# EAGLE design gsm (EAGLE 6.3)
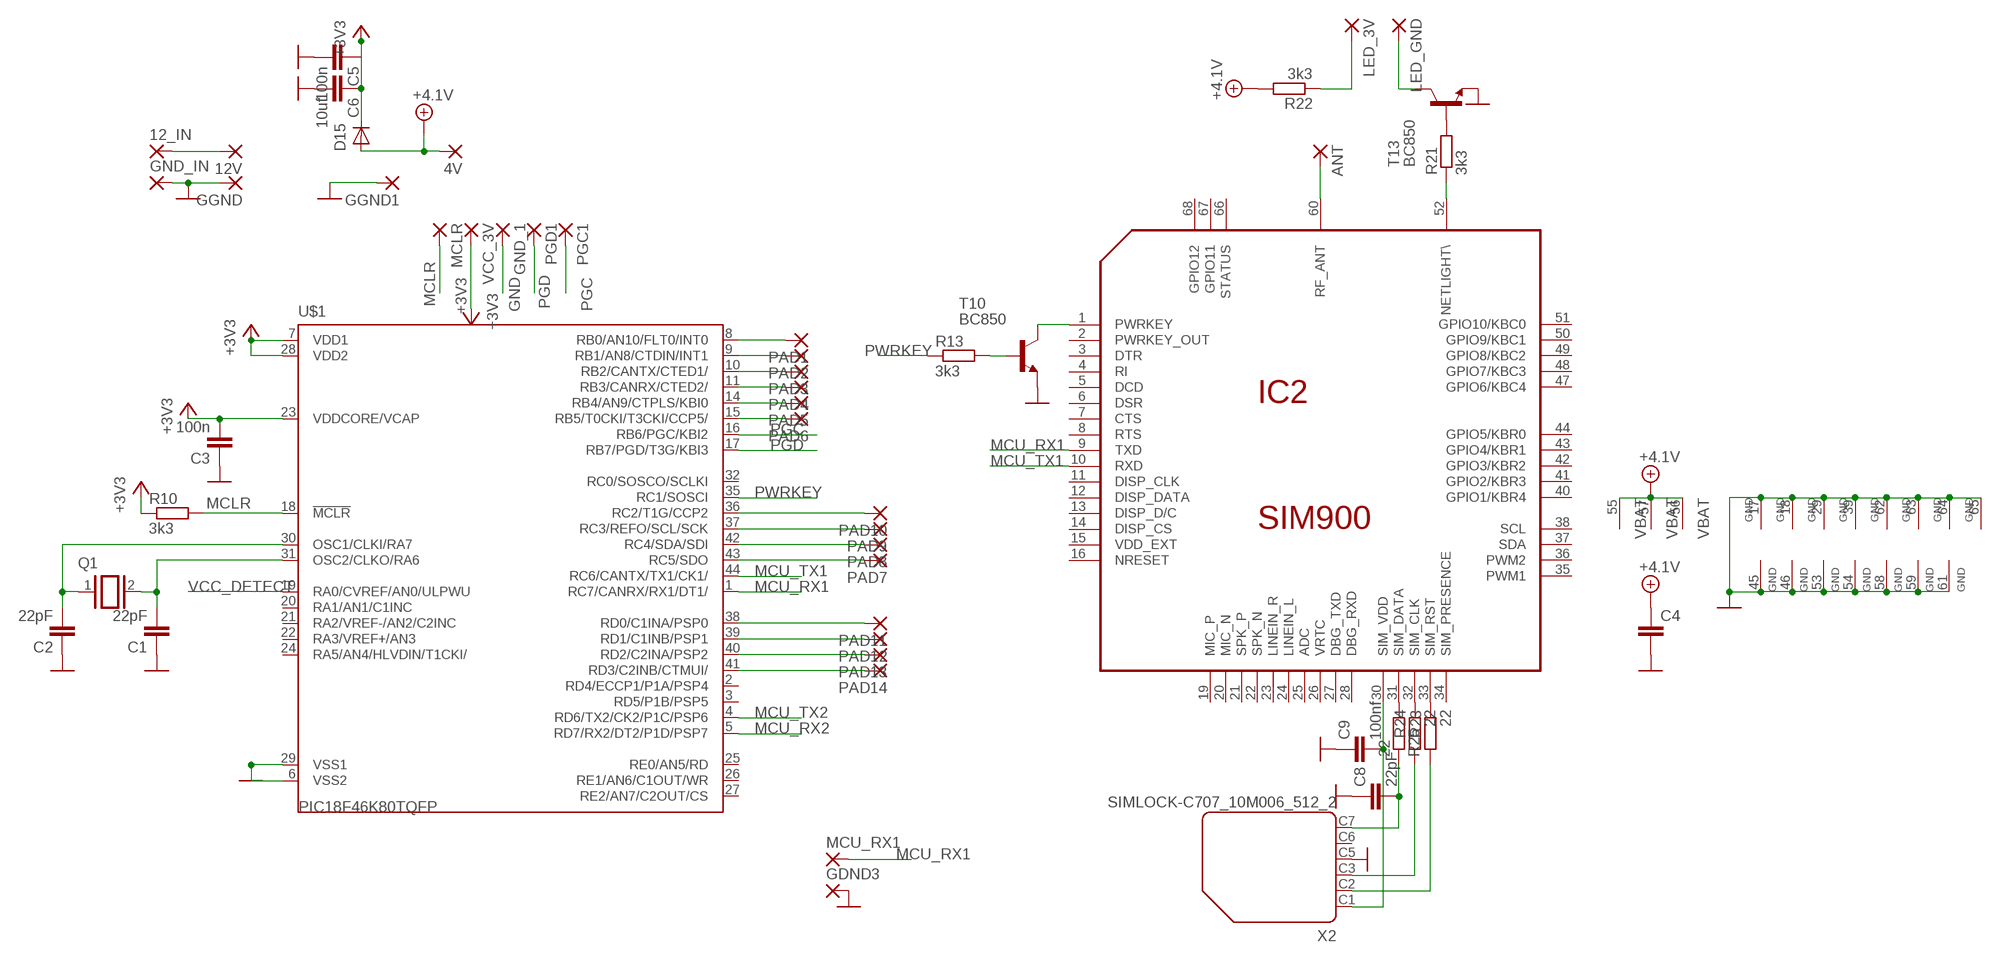
[diagram p0: schematic, sheet 1]

## Parts
4V  SMD2  [SMD1,27-2,54]
12_IN  2,15/1,0  [2,15/1,0]
12V  SMD2  [SMD1,27-2,54]
ANT  2,54/0,8  [2,54/0,8]
C1  22pF  C-EUC1206  [C1206]
C2  22pF  C-EUC1206  [C1206]
C3  100n  C-EUC1206  [C1206]
C4  C-EU025-050X050  [C025-050X050]
C5  100n  C-EUC1206  [C1206]
C6  10uf  C-EUC1206  [C1206]
C8  22pF  C-EUC1206K  [C1206K]
C9  100nf  C-EUC1206K  [C1206K]
D15  GF1  [SMA-DO214AC]
GDND3  2,15/1,0  [2,15/1,0]
GGND  SMD2  [SMD1,27-2,54]
GGND1  SMD2  [SMD1,27-2,54]
GND_1  2,15/1,0  [2,15/1,0]
GND_IN  2,15/1,0  [2,15/1,0]
IC2  SIM900  [SIM900]
LED_3V  WIREPAD2,15/1,0  [2,15/1,0]
LED_GND  WIREPAD2,15/1,0  [2,15/1,0]
MCLR  2,15/1,0  [2,15/1,0]
MCU_RX1  2,15/1,0  [2,15/1,0]
PAD1  SMD2  [SMD1,27-2,54]
PAD2  SMD2  [SMD1,27-2,54]
PAD3  SMD2  [SMD1,27-2,54]
PAD4  SMD2  [SMD1,27-2,54]
PAD5  SMD2  [SMD1,27-2,54]
PAD6  SMD2  [SMD1,27-2,54]
PAD7  SMD2  [SMD1,27-2,54]
PAD8  SMD2  [SMD1,27-2,54]
PAD9  SMD2  [SMD1,27-2,54]
PAD10  SMD2  [SMD1,27-2,54]
PAD11  SMD2  [SMD1,27-2,54]
PAD12  SMD2  [SMD1,27-2,54]
PAD13  SMD2  [SMD1,27-2,54]
PAD14  SMD2  [SMD1,27-2,54]
PGC1  2,15/1,0  [2,15/1,0]
PGD1  2,15/1,0  [2,15/1,0]
Q1  XTAL/S  [QS]
R10  3k3  R-EU_M3216  [M3216]
R13  3k3  R-EU_M3216  [M3216]
R21  3k3  R-EU_M3216  [M3216]
R22  3k3  R-EU_M3216  [M3216]
R23  22  R-EU_M1206  [M1206]
R24  22  R-EU_M1206  [M1206]
R25  22  R-EU_M1206  [M1206]
T10  BC850  [SOT23]
T13  BC850  [SOT23]
U$1  PIC18F46K80TQFP  [TQFP44]
VCC_3V  2,15/1,0  [2,15/1,0]
X2  SIMLOCK-C707_10M006_512_2  [C707_10M006_512_2]

## Nets
+3V3: C3.2 C5.1 C6.1 D15.K(C) R10.1 U$1.7(VDD1) U$1.23(VDDCORE/VCAP) U$1.28(VDD2) VCC_3V.1(P)
+4.1V: 4V.1(P) C4.1 D15.A IC2.55(VBAT) IC2.56(VBAT) IC2.57(VBAT) R22.2
GND: C1.1 C2.1 C3.1 C4.2 C5.2 C6.2 C8.1 C9.1 GDND3.1(P) GGND1.1(P) GGND.1(P) GND_1.1(P) GND_IN.1(P) IC2.17(GND) IC2.18(GND) IC2.29(GND) IC2.39(GND) IC2.45(GND) IC2.46(GND) IC2.53(GND) IC2.54(GND) IC2.58(GND) IC2.59(GND) IC2.61(GND) IC2.62(GND) IC2.63(GND) IC2.64(GND) IC2.65(GND) T10.2(E) T13.2(E) U$1.6(VSS2) U$1.29(VSS1) X2.C5
MCLR: MCLR.1(P) R10.2 U$1.18(!MCLR)
MCU_RX1: IC2.9(TXD) MCU_RX1.1(P) U$1.1(RC7/CANRX/RX1/DT1/)
MCU_RX2: U$1.5(RD7/RX2/DT2/P1D/PSP7)
MCU_TX1: IC2.10(RXD) U$1.44(RC6/CANTX/TX1/CK1/)
MCU_TX2: U$1.4(RD6/TX2/CK2/P1C/PSP6)
N$1: 12_IN.1(P) 12V.1(P)
N$6: PAD1.1(P) U$1.8(RB0/AN10/FLT0/INT0)
N$7: PAD2.1(P) U$1.9(RB1/AN8/CTDIN/INT1)
N$8: PAD3.1(P) U$1.10(RB2/CANTX/CTED1/)
N$9: PAD4.1(P) U$1.11(RB3/CANRX/CTED2/)
N$10: PAD5.1(P) U$1.14(RB4/AN9/CTPLS/KBI0)
N$11: PAD6.1(P) U$1.15(RB5/T0CKI/T3CKI/CCP5/)
N$13: PAD7.1(P) U$1.43(RC5/SDO)
N$14: PAD8.1(P) U$1.42(RC4/SDA/SDI)
N$15: PAD9.1(P) U$1.37(RC3/REFO/SCL/SCK)
N$16: PAD10.1(P) U$1.36(RC2/T1G/CCP2)
N$17: PAD11.1(P) U$1.38(RD0/C1INA/PSP0)
N$18: PAD12.1(P) U$1.39(RD1/C1INB/PSP1)
N$19: PAD13.1(P) U$1.40(RD2/C2INA/PSP2)
N$20: PAD14.1(P) U$1.41(RD3/C2INB/CTMUI/)
N$48: C2.2 Q1.1 U$1.30(OSC1/CLKI/RA7)
N$49: C1.2 Q1.2 U$1.31(OSC2/CLKO/RA6)
N$51: R13.2 T10.1(B)
N$52: IC2.1(PWRKEY) T10.3(C)
N$64: ANT.1(P) IC2.60(RF_ANT)
N$65: IC2.52(NETLIGHT\) R21.1
N$66: R21.2 T13.1(B)
N$67: LED_GND.1(P) T13.3(C)
N$68: LED_3V.1(P) R22.1
N$69: C9.2 IC2.30(SIM_VDD) X2.C1
N$70: R23.2 X2.C2
N$71: R24.2 X2.C3
N$72: C8.2 R25.1 X2.C7
N$73: IC2.33(SIM_RST) R23.1
N$74: IC2.32(SIM_CLK) R24.1
N$75: IC2.31(SIM_DATA) R25.2
PGC: PGC1.1(P) U$1.16(RB6/PGC/KBI2)
PGD: PGD1.1(P) U$1.17(RB7/PGD/T3G/KBI3)
PWRKEY: R13.1 U$1.35(RC1/SOSCI)
VCC_DETECT: U$1.19(RA0/CVREF/AN0/ULPWU)
Unconnected: IC2.2(PWRKEY_OUT) IC2.3(DTR) IC2.4(RI) IC2.5(DCD) IC2.6(DSR) IC2.7(CTS) IC2.8(RTS) IC2.11(DISP_CLK) IC2.12(DISP_DATA) IC2.13(DISP_D/C) IC2.14(DISP_CS) IC2.15(VDD_EXT) IC2.16(NRESET) IC2.19(MIC_P) IC2.20(MIC_N) IC2.21(SPK_P) IC2.22(SPK_N) IC2.23(LINEIN_R) IC2.24(LINEIN_L) IC2.25(ADC) IC2.26(VRTC) IC2.27(DBG_TXD) IC2.28(DBG_RXD) IC2.34(SIM_PRESENCE) IC2.35(PWM1) IC2.36(PWM2) IC2.37(SDA) IC2.38(SCL) IC2.40(GPIO1/KBR4) IC2.41(GPIO2/KBR3) IC2.42(GPIO3/KBR2) IC2.43(GPIO4/KBR1) IC2.44(GPIO5/KBR0) IC2.47(GPIO6/KBC4) IC2.48(GPIO7/KBC3) IC2.49(GPIO8/KBC2) IC2.50(GPIO9/KBC1) IC2.51(GPIO10/KBC0) IC2.66(STATUS) IC2.67(GPIO11) IC2.68(GPIO12) U$1.2(RD4/ECCP1/P1A/PSP4) U$1.3(RD5/P1B/PSP5) U$1.20(RA1/AN1/C1INC) U$1.21(RA2/VREF-/AN2/C2INC) U$1.22(RA3/VREF+/AN3) U$1.24(RA5/AN4/HLVDIN/T1CKI/) U$1.25(RE0/AN5/RD) U$1.26(RE1/AN6/C1OUT/WR) U$1.27(RE2/AN7/C2OUT/CS) U$1.32(RC0/SOSCO/SCLKI) X2.C6

## Library data of the parts
4V 12V GGND GGND1 PAD1-PAD14 = wirepad:SMD2: SMD PAD
12_IN GDND3 GND_1 GND_IN MCLR MCU_RX1 PGC1 PGD1 VCC_3V = wirepad:2,15/1,0: THROUGH-HOLE PAD
ANT = wirepad:2,54/0,8: THROUGH-HOLE PAD
C1-C3 C5 C6 = resistor:C-EU: CAPACITOR, European symbol
C4 C8 C9 = rcl:C-EU: CAPACITOR, European symbol
D15 = diode:GF1: DIODE
IC2 = sim900:SIM900
LED_3V LED_GND = wirepad:WIREPAD: Wire PAD connect wire on PCB
Q1 = special:XTAL/S: CRYSTAL
R10 R13 R21 R22 = rcl:R-EU_: RESISTOR, European symbol
R23-R25 = resistor:R-EU_: RESISTOR, European symbol
T10 T13 = transistor:BC850: NPN TRANSISTOR
U$1 = microchip:PIC18F46K80TQFP
X2 = con-amphenol:SIMLOCK-C707_10M006_512_2: C707A SIMLOCK® 2.5 mm with wide solder tails Source: Data sheet <http://www.amphenol.info/downloads/C707_10M006_512_2.pdf>; OC_FARNELL: unknown; OC_NEWARK: unknown

## Net classes
0 default: clearance 0.355 mm

## Board
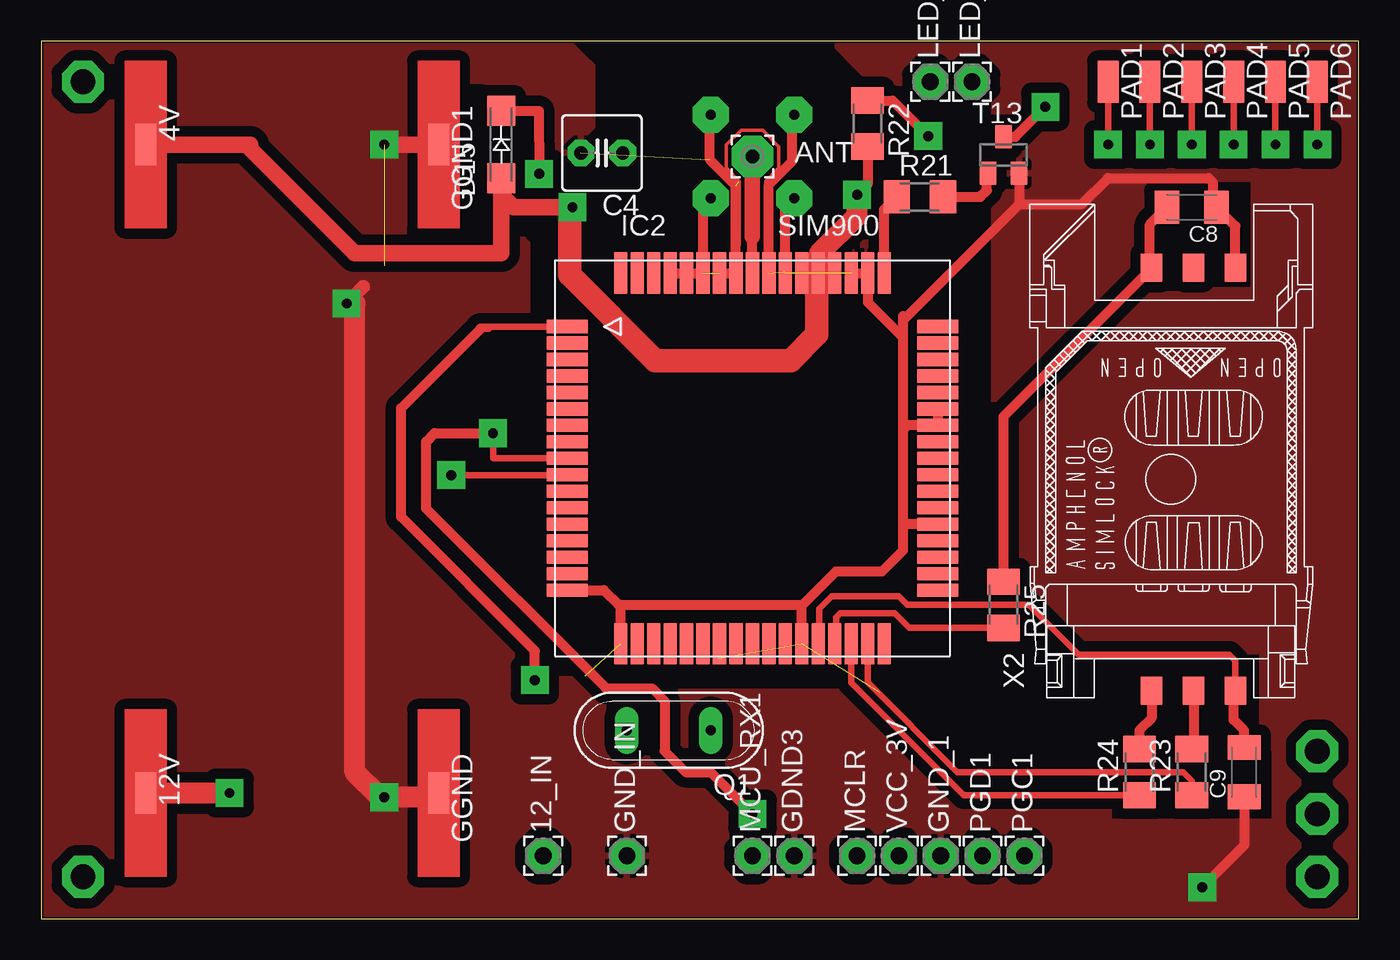
[diagram p1: board, top side]
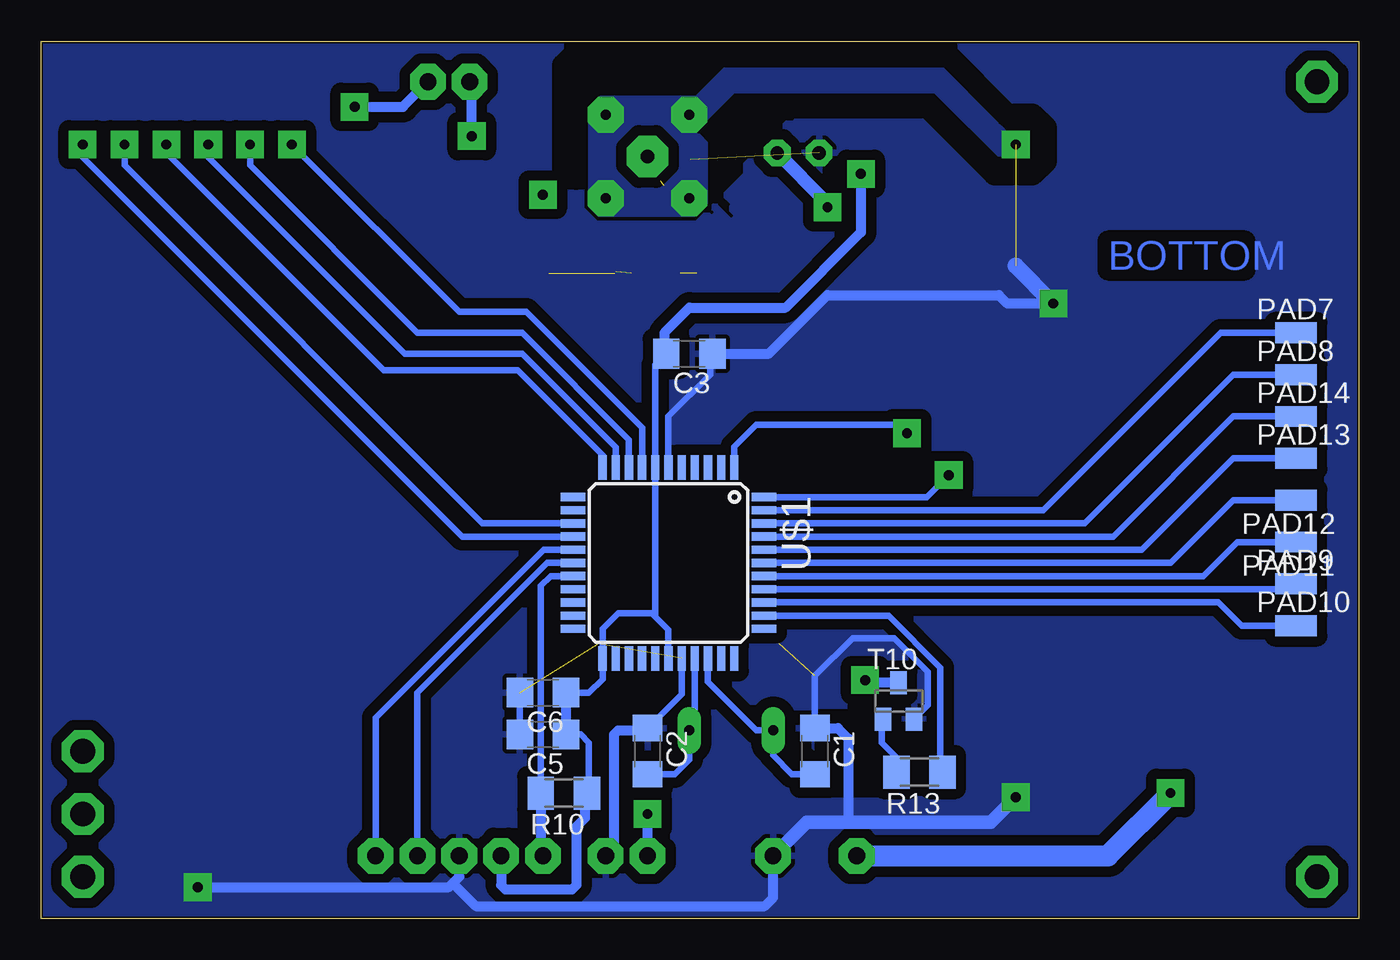
[diagram p2: board, bottom side, seen from below]

Size 79.99 x 53.26 mm. Coordinates in mm from the lower left corner, seen from the top.
Outline: 0,0 79.99,0 79.99,53.26 0,53.26 0,0
Copper layers (1*16): Top 0.035mm / dielectric 1.5mm / Bottom 0.035mm
Design rules "default *": minimum track width 10mil, minimum drill 24mil, track to track 25mil, track to pad 25mil, pad to pad 25mil, via to via 25mil, smd to smd 25mil, copper to edge 5mil, drill to drill 8mil, minimum pad ring 16mil, minimum via ring 8mil, stop-mask expansion 4mil, vias tented up to drill 0mil, thermal gap 10mil
tRestrict: area 31.2,16 to 55.1,39.9; area 30,16 to 32,20.6; area 30,16.5 to 31.7,26.4; area 32.5,38.6 to 48.8,41.1; area 31.2,38.6 to 33,41.1; area 53.8,19.1 to 56.4,32; area 34.5,14.7 to 50,16.8; area 33.5,14.7 to 37.3,16.3; area 30,14.7 to 34,16.5; area 29.7,35.8 to 37.1,41.1; area 67.1,38.4 to 73.4,44.5; area 67.8,42.9 to 73.4,44.7; 11 more areas; 23 lines
bRestrict: area 43.7,7.4 to 47,13.2; area 43.7,7.4 to 46.5,15.5; area 49.3,4.3 to 51.1,7.1; area 25.9,9.9 to 28.2,11.9; area 40.9,12.2 to 43.9,14.5; area 28.2,7.4 to 33,12.7; area 43.7,4.6 to 47,7.9; 54 lines

### Footprints (pad centres in the part's own frame; a part is rotated, then mirrored left to right if it is on the bottom)
SMD1,27-2,54 = smd 1.27 x 2.54: 1 0,0
2,15/1,0 = drill 1.016 pad 2.159 octagon: 1 0,0
2,54/0,8 = drill 0.813 pad 2.54 octagon: 1 0,0
C1206 = smd 1.6 x 1.8: 1 -1.4,0; 2 1.4,0
C025-050X050 = drill 0.813 octagon: 1 -1.27,0; 2 1.27,0
C1206K = smd 1.5 x 2: 1 -1.5,0; 2 1.5,0
SMA-DO214AC = smd 1.8 x 1.7: A -2.05,0; K 2.05,0
SIM900 = smd 2.5 x 0.8: 1 -11.25,8; 2 -11.25,7; 3 -11.25,6; 4 -11.25,5; 5 -11.25,4; 6 -11.25,3; 7 -11.25,2; 8 -11.25,1; 9 -11.25,0; 10 -11.25,-1; 11 -11.25,-2; 12 -11.25,-3; 13 -11.25,-4; 14 -11.25,-5; 15 -11.25,-6; 16 -11.25,-7; 17 -11.25,-8; 35 11.25,-8; 36 11.25,-7; 37 11.25,-6; 38 11.25,-5; 39 11.25,-4; 40 11.25,-3; 41 11.25,-2; 42 11.25,-1; 43 11.25,0; 44 11.25,1; 45 11.25,2; 46 11.25,3; 47 11.25,4; 48 11.25,5; 49 11.25,6; 50 11.25,7; 51 11.25,8 | smd 0.8 x 2.5: 18 -8,-11.25; 19 -7,-11.25; 20 -6,-11.25; 21 -5,-11.25; 22 -4,-11.25; 23 -3,-11.25; 24 -2,-11.25; 25 -1,-11.25; 26 0,-11.25; 27 1,-11.25; 28 2,-11.25; 29 3,-11.25; 30 4,-11.25; 31 5,-11.25; 32 6,-11.25; 33 7,-11.25; 34 8,-11.25; 52 8,11.25; 53 7,11.25; 54 6,11.25; 55 5,11.25; 56 4,11.25; 57 3,11.25; 58 2,11.25; 59 1,11.25; 60 0,11.25; 61 -1,11.25; 62 -2,11.25; 63 -3,11.25; 64 -4,11.25; 65 -5,11.25; 66 -6,11.25; 67 -7,11.25; 68 -8,11.25
QS = drill 0.61 long: 1 -2.54,0; 2 2.54,0
M3216 = smd 1.6 x 2: 1 -1.4,0; 2 1.4,0
M1206 = smd 1.6 x 2: 1 -1.4,0; 2 1.4,0
SOT23 = smd 1 x 1.4: 1 -0.95,-1.1; 2 0.95,-1.1; 3 0,1.1
TQFP44 = smd 1.5 x 0.5: 1 -5.8,4; 2 -5.8,3.2; 3 -5.8,2.4; 4 -5.8,1.6; 5 -5.8,0.8; 6 -5.8,0; 7 -5.8,-0.8; 8 -5.8,-1.6; 9 -5.8,-2.4; 10 -5.8,-3.2; 11 -5.8,-4; 23 5.8,-4; 24 5.8,-3.2; 25 5.8,-2.4; 26 5.8,-1.6; 27 5.8,-0.8; 28 5.8,0; 29 5.8,0.8; 30 5.8,1.6; 31 5.8,2.4; 32 5.8,3.2; 33 5.8,4 | smd 0.5 x 1.5: 12 -4,-5.8; 13 -3.2,-5.8; 14 -2.4,-5.8; 15 -1.6,-5.8; 16 -0.8,-5.8; 17 0,-5.8; 18 0.8,-5.8; 19 1.6,-5.8; 20 2.4,-5.8; 21 3.2,-5.8; 22 4,-5.8; 34 4,5.8; 35 3.2,5.8; 36 2.4,5.8; 37 1.6,5.8; 38 0.8,5.8; 39 0,5.8; 40 -0.8,5.8; 41 -1.6,5.8; 42 -2.4,5.8; 43 -3.2,5.8; 44 -4,5.8
C707_10M006_512_2 = smd 1.7 x 1.3: C1 -12.85,-3.915; C2 -12.85,-1.375; C3 -12.85,1.165; C5 12.85,-3.915; C6 12.85,-1.375; C7 12.85,1.165

### Placement (x,y rotation side)
4V  6.35,46.99 180 top
12_IN  30.48,3.81 0 top
12V  6.35,7.62 180 top
ANT  43.18,46.26 0 top
C1  33.02,10.16 270 bottom
C2  43.18,10.16 270 bottom
C3  40.64,34.29 180 bottom
C4  34.04,46.48 180 top
C5  49.53,11.18 180 bottom
C6  49.53,13.72 180 bottom
C8  69.85,43.18 180 top
C9  73.02,8.89 90 top
D15  27.94,46.99 90 top
GDND3  45.72,3.81 0 top
GGND  24.13,7.62 180 top
GGND1  24.13,46.99 180 top
GND_1  54.61,3.81 0 top
GND_IN  35.56,3.81 0 top
IC2  43.18,27.94 0 top
LED_3V  53.97,50.8 0 top
LED_GND  56.52,50.8 0 top
MCLR  49.53,3.81 0 top
MCU_RX1  43.18,3.81 0 top
PAD1  64.77,50.8 180 top
PAD2  67.31,50.8 180 top
PAD3  69.85,50.8 180 top
PAD4  72.39,50.8 180 top
PAD5  74.93,50.8 180 top
PAD6  77.47,50.8 180 top
PAD7  3.81,35.56 270 bottom
PAD8  3.81,33.02 270 bottom
PAD9  3.81,20.32 270 bottom
PAD10  3.81,17.78 270 bottom
PAD11  3.81,22.86 90 bottom
PAD12  3.81,25.4 90 bottom
PAD13  3.81,27.94 270 bottom
PAD14  3.81,30.48 270 bottom
PGC1  59.69,3.81 0 top
PGD1  57.15,3.81 0 top
Q1  38.1,11.43 180 top
R10  48.26,7.62 180 bottom
R13  26.67,8.89 180 bottom
R21  53.34,43.82 0 top
R22  50.16,48.26 270 top
R23  69.85,8.89 90 top
R24  66.67,8.89 90 top
R25  58.42,19.05 270 top
T10  27.94,13.21 0 bottom
T13  58.42,46.36 0 top
U$1  41.91,21.59 270 bottom
VCC_3V  52.07,3.81 0 top
X2  68.58,26.67 90 top

### Tracks (layer width: path | path; a pad name or v marks a point on that pad's centre or on a via)
+3V3  (via drill 0.6 pad 1.68)
  Top 0.61: D15.K 30.21,49.04 v30.23,45.21
  Bottom 0.406: C3.2 42.71,33.62 U$1.7 42.71,18.33 | 42.71,18.33 41.91,17.53 U$1.28 | 42.71,18.33 42.93,18.54 44.96,18.54 45.91,17.59 U$1.23 45.91,14.54 46.74,13.72 C6.1 | R10.1 46.74,7.74 46.74,10.67 47.24,11.18 C5.1
  Bottom 0.61: VCC_3V.1 52.07,2.03 51.82,1.78 47.75,1.78 47.5,2.03 47.5,5.59 46.99,6.1 46.99,7.49 R10.1 | v30.23,45.21 30.23,41.66 34.8,37.08 40.64,37.08 42.16,35.56 42.16,34.41 C3.2 | C6.1 C5.1
+4.1V  (via drill 0.6 pad 1.68)
  Top 0.2: 45.97,39.12 47.04,39.12 47.09,39.07
  Top 0.61: IC2.55 IC2.56 | IC2.56 IC2.57 47.06,39.19 47.24,39.37 | R22.2 50.16,44.58 v49.53,43.94 | 47.04,39.12 47.11,39.12 IC2.56
  Top 0.813: IC2.55 47.32,39.19 47.24,39.12
  Top 1.016: 4V.1 12.45,46.99 | 12.45,46.99 12.7,46.99 | 27.94,43.94 27.94,40.39 19.05,40.39 12.45,46.99 | 27.94,43.94 D15.A | v32.26,43.18 28.7,43.18 27.94,43.94
  Top 1.27: 47.24,39.12 47.24,40.39 49.53,42.67 v49.53,43.94
  Top 1.422: 47.09,39.07 47.09,35.47 45.49,33.87 37.29,33.87 32.09,39.07 32.09,43.01 v32.26,43.18
  Bottom 0.813: v32.26,43.18 32.26,43.43 C4.1
  Bottom 1.27: 49.4,43.82 v49.53,43.94
GND  (via drill 0.6 pad 1.68, 0.6 pad 2.18)  (9 unrouted)
  Top 0.2: 43.99,40.07 43.99,44.77 | 43.99,44.77 44.79,45.57 44.79,46.87 43.79,47.87 42.49,47.87 41.59,46.97 41.59,45.57 42.39,44.77 42.39,40.87 | 44.18,44.56 44.18,44.58 43.99,44.77
  Top 0.61: C9.1 73.02,4.45 v70.48,1.91 | IC2.17 34.16,19.94 35.05,19.05 | 35.05,19.05 46.23,19.05 | 46.23,19.05 48.26,21.08 51.05,21.08 52.32,22.35 52.32,23.88 | 52.32,23.88 52.32,29.72 | 52.32,29.72 52.32,35.27 | 52.32,35.27 52.32,36.32 | 52.32,36.32 52.32,36.58 | IC2.65 IC2.64 IC2.63 40.18,43.26 v40.64,43.72 | IC2.62 IC2.61 42.18,44.48 40.59,46.07 40.59,48.75 v40.64,48.8 | IC2.54 IC2.53 50.18,37.41 52.32,35.27 | IC2.46 IC2.45 52.55,29.94 52.32,29.72 | IC2.39 52.39,23.94 52.32,23.88 | IC2.29 46.18,19 46.23,19.05 | IC2.18 35.18,18.92 35.05,19.05 | T13.2 59.37,43.37 | 59.37,43.37 52.32,36.32 | X2.C5 72.49,42.04 C8.1 71.12,43.41 71.12,44.7 70.87,44.96 64.77,44.96 63.18,43.37 59.37,43.37 | v45.72,43.72 45.18,43.18 IC2.58 45.1,39.27 | IC2.59 44.18,44.56 45.59,45.97 45.59,48.67 v45.72,48.8
  Top 0.813: 19.56,38.35 v18.54,37.34
  Top 1.016: GGND1.1 v20.83,46.99 | 23.88,7.37 GGND.1
  Top 1.27: v18.54,37.34 19.05,37.34 19.05,8.89 20.57,7.37 v20.83,7.37 23.88,7.37
  Bottom 0.406: U$1.6 41.91,30.48 39.37,33.02 39.37,34.16 C3.1 | U$1.29 41.11,13.63 C2.1 | C5.2 C6.2 | T10.2 26.99,12.13 26.16,12.95 26.16,14.99 28.19,17.02 30.73,17.02 33.02,14.73 C1.1
  Bottom 0.61: v70.48,1.91 55.24,1.91 54.99,2.16 | 54.99,2.16 54.61,2.54 GND_1.1 | C1.1 31.63,11.56 30.99,10.92 30.99,5.84 | 54.99,2.16 53.59,0.76 36.07,0.76 35.56,1.27 GND_IN.1 | C2.1 43.31,11.43 44.96,11.43 45.21,11.18 45.21,4.32 GDND3.1 | C3.1 35.81,34.29 32.26,37.85 21.84,37.85 21.34,37.34 v18.54,37.34
  Bottom 0.813: v20.83,7.37 22.35,5.84 30.99,5.84 33.53,5.84 GND_IN.1
  Bottom 1.016: 20.83,39.62 v18.54,37.34
  pour Top: 0,53.34 80.01,53.34 80.01,0 0,0
  pour Bottom: 0,53.34 80.01,53.34 80.01,0 0,0
MCLR
  Bottom 0.406: U$1.18 49.06,20.79 49.66,20.19 R10.2
  Bottom 0.61: R10.2 49.66,3.94 MCLR.1
MCU_RX1  (via drill 0.6 pad 1.68)
  Top 0.406: v27.43,29.46 27.43,27.94 IC2.9
  Top 0.61: v27.43,29.46 23.88,29.46 23.37,28.96 23.37,24.89 34.29,13.97 37.08,13.97 37.85,13.21 37.85,10.16 39.12,8.89 40.64,8.89 v43.18,6.35
  Bottom 0.406: U$1.1 37.91,28.64 36.58,29.97 27.94,29.97 v27.43,29.46
  Bottom 0.61: MCU_RX1.1 v43.18,6.35
MCU_TX1  (via drill 0.6 pad 1.68)
  Top 0.406: v24.89,26.92 31.91,26.92 IC2.10
  Bottom 0.406: U$1.44 26.23,25.59 v24.89,26.92
N$1  (via drill 0.6 pad 1.68)
  Top 1.27: v11.43,7.62 12V.1
  Bottom 1.27: 12_IN.1 15.24,3.81 v11.43,7.62
N$2  (via drill 1.5 pad 2.54)
  other vias: 2.54,2.54
N$3  (via drill 1.5 pad 2.54)
  other vias: 2.54,50.8
N$4  (via drill 1.5 pad 2.54)
  other vias: 77.47,2.54
N$5  (via drill 1.5 pad 2.54)
  other vias: 77.47,6.35
N$6  (via drill 0.6 pad 1.68)
  Top 0.406: PAD1.1 v64.77,46.99
  Bottom 0.406: v64.77,46.99 54.61,36.83 50.55,36.83 43.51,29.79 U$1.8
N$7  (via drill 0.6 pad 1.68)
  Top 0.406: v67.31,46.99 67.31,50.04 67.06,50.29 67.06,50.55 PAD2.1
  Bottom 0.406: U$1.9 44.31,29.07 50.8,35.56 57.15,35.56 67.31,45.72 v67.31,46.99
N$8  (via drill 0.6 pad 1.68)
  Top 0.406: v69.85,46.99 PAD3.1
  Bottom 0.406: U$1.10 45.11,28.6 50.8,34.29 57.91,34.29 69.85,46.23 v69.85,46.99
N$9  (via drill 0.6 pad 1.68)
  Top 0.406: v72.39,46.99 PAD4.1
  Bottom 0.406: U$1.11 45.91,28.13 51.05,33.27 59.18,33.27 72.39,46.48 v72.39,46.99
N$10  (via drill 0.6 pad 1.68)
  Top 0.406: v74.93,46.99 PAD5.1
  Bottom 0.406: U$1.14 53.2,23.99 74.93,45.72 v74.93,46.99
N$11  (via drill 0.6 pad 1.68)
  Top 0.406: v77.47,46.99 PAD6.1
  Bottom 0.406: U$1.15 54.43,23.19 77.47,46.23 v77.47,46.99
N$12  (via drill 1.5 pad 2.54)
  other vias: 77.47,10.16
N$13
  Bottom 0.406: U$1.43 19.15,24.79 8.38,35.56 PAD7.1
N$14
  Bottom 0.406: U$1.42 16.65,23.99 7.62,33.02 PAD8.1
N$15
  Bottom 0.406: U$1.37 4.14,19.99 PAD9.1
N$16
  Bottom 0.406: U$1.36 8.52,19.19 7.11,17.78 PAD10.1
N$17
  Bottom 0.406: U$1.38 9.44,20.79 7.37,22.86 PAD11.1
N$18
  Bottom 0.406: U$1.39 11.43,21.59 7.62,25.4 PAD12.1
N$19
  Bottom 0.406: U$1.40 13.17,22.39 7.62,27.94 PAD13.1
N$20
  Bottom 0.406: U$1.41 14.91,23.19 7.62,30.48 PAD14.1
N$48
  Bottom 0.406: U$1.30 40.31,11.76 Q1.1 40.64,9.65 41.53,8.76 C2.2
N$49
  Bottom 0.406: U$1.31 39.51,14.36 36.58,11.43 Q1.2 35.56,9.91 34.41,8.76 C1.2
N$51
  Bottom 0.406: R13.2 28.07,9.78 28.96,10.67 28.96,12.04 T10.1
N$52  (via drill 0.6 pad 1.68)
  Top 0.406: 27.18,35.81 26.67,35.81 26.8,35.94 IC2.1
  Top 0.61: v29.97,14.48 29.97,16.26 21.84,24.38 21.84,30.99 26.67,35.81
  Bottom 0.61: T10.3 29.8,14.31 v29.97,14.48
N$64
  Top 0.6: IC2.60 43.18,41.4
  Top 0.93: 43.18,41.4 ANT.1
N$65
  Top 0.61: IC2.52 51.18,43.05 R21.1
N$66
  Top 0.61: R21.2 57.02,43.82 57.4,44.2 57.4,45.19 T13.1
N$67  (via drill 0.6 pad 1.68)
  Top 0.61: T13.3 59.14,47.46 v60.96,49.28
  Bottom 0.61: v60.96,49.28 58.04,49.28 LED_GND.1
N$68  (via drill 0.6 pad 1.68)
  Top 0.61: R22.1 51.69,49.66 v53.85,47.5
  Bottom 0.61: v53.85,47.5 53.85,50.67 LED_3V.1
N$69
  Top 0.406: X2.C1 72.49,15.64 72.14,16 62.99,16 59.94,19.05 52.58,19.05 52.07,19.56 48.01,19.56 47.24,18.8 47.24,16.75 IC2.30
  Top 0.61: C9.2 73.02,11.43 72.39,12.06 72.39,13.71 X2.C1
N$70
  Top 0.61: X2.C2 69.95,10.39 R23.2
N$71
  Top 0.61: X2.C3 67.41,12.17 66.67,11.43 R24.2
N$72
  Top 0.61: R25.1 58.42,30.48 67.31,39.37 67.31,39.42 X2.C7 67.31,39.62 67.31,42.14 C8.2
N$73
  Top 0.406: R23.1 69.85,8.38 69.34,8.89 55.63,8.89 50.16,14.35 50.16,16.68
  Top 0.61: 50.16,16.68 IC2.33
N$74
  Top 0.406: R24.1 56.01,7.49 49.18,14.32 IC2.32
N$75
  Top 0.406: R25.2 52.71,17.65 51.82,18.54 48.51,18.54 48.26,18.29 48.26,16.77 IC2.31
PGC
  Bottom 0.406: U$1.16 49.49,22.39 59.69,12.19 PGC1.1
PGD
  Bottom 0.406: U$1.17 49.28,21.59 57.15,13.72 PGD1.1
PWRKEY
  Bottom 0.406: U$1.35 28.55,18.39 25.4,15.24 25.4,9.02 R13.1
(copper drawn outside any net)
  shapes: Top area x4

### Text on the board
Bottom: BOTTOM